# EasyEDA schematic CAN-Breakout.json
TITLE: Sheet_1; REV: 1.0; Date: 2020-12-29; Sheet: 1/1; Drawn By: atanasovgoran94; Company: Your Company
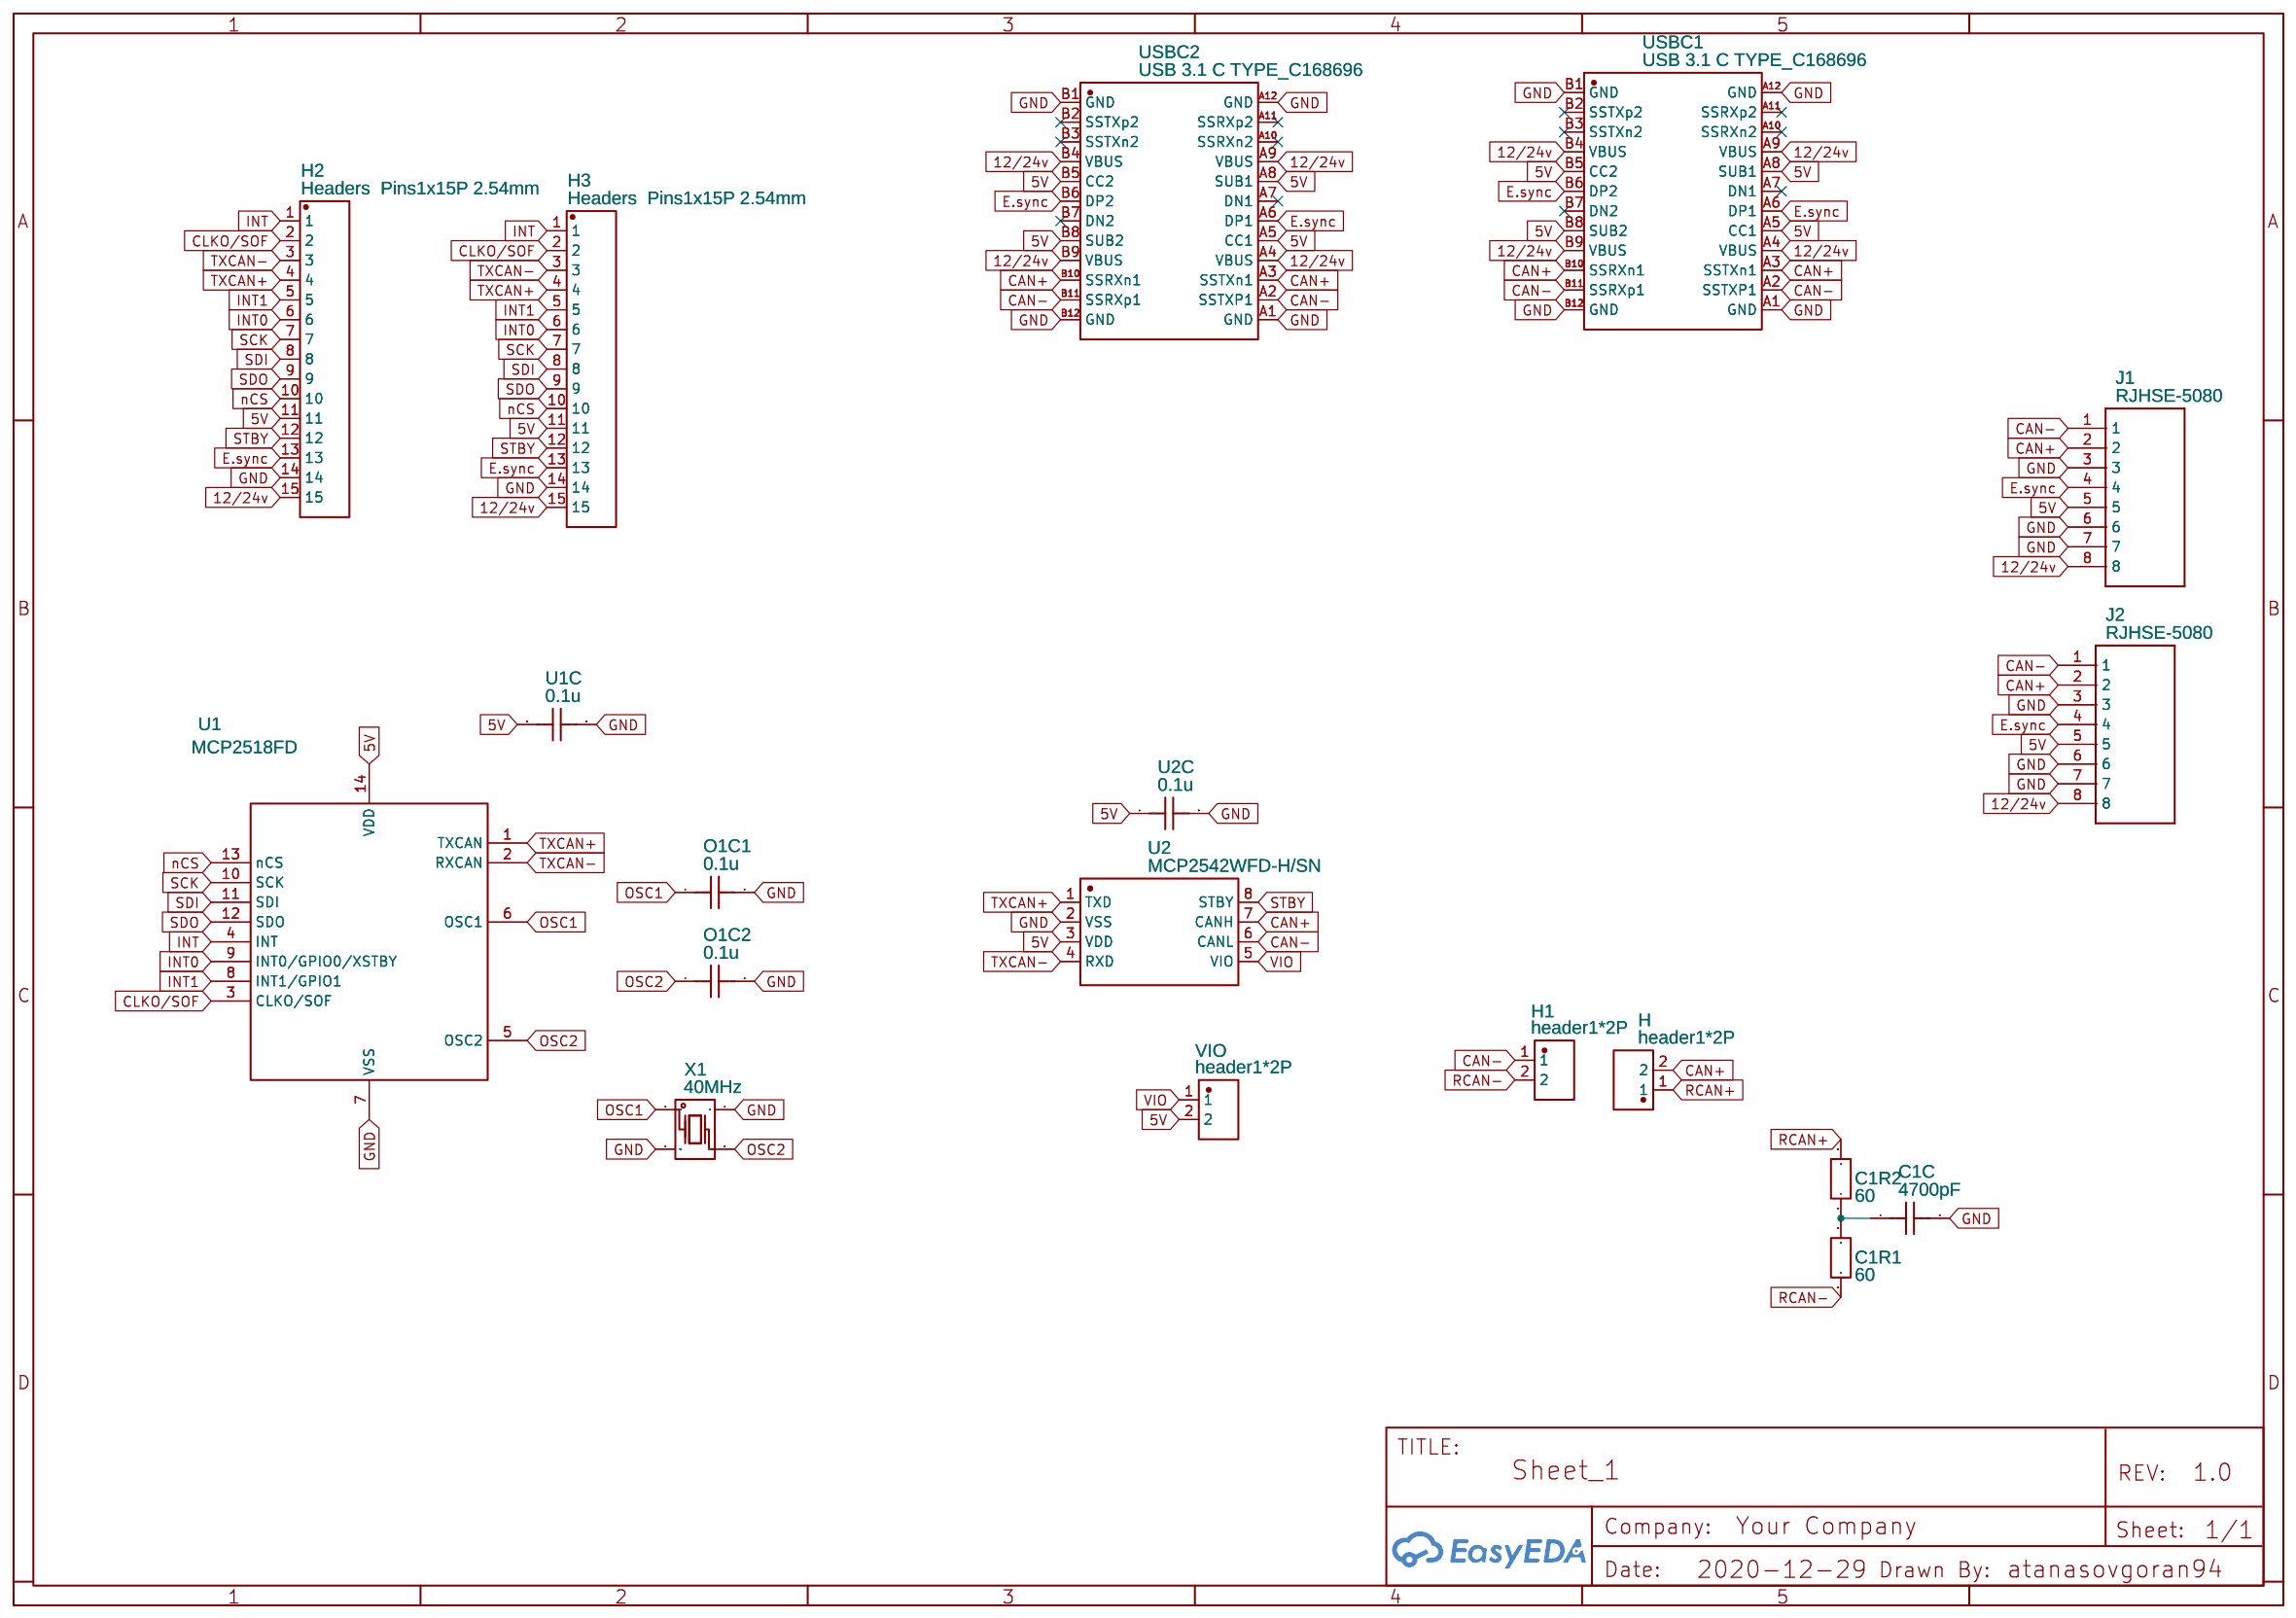
[diagram p0: schematic sheet]

## Parts
C1C  4700pF  [C0402]
C1R1  60  [R0402]
C1R2  60  [R0402]
H  header1*2P  [HDR-TH_2P-P2.00-V]
H1  header1*2P  [HDR-TH_2P-P2.00-V]
H2  Headers  Pins1x15P 2.54mm  [HDR-TH_15P-P2.54-V]
H3  Headers  Pins1x15P 2.54mm  [HDR-TH_15P-P2.54-V]
J1  RJHSE-5080  [AMPHENOL_RJHSE-5080]
J2  RJHSE-5080  [AMPHENOL_RJHSE-5080]
O1C1  0.1u  [C0402]
O1C2  0.1u  [C0402]
U1  MCP2518FD  [MCP2518]
U1C  0.1u  [C0402]
U2  MCP2542WFD-H/SN  [SOIC-8_L4.9-W3.9-P1.27-LS6.0-BL]
U2C  0.1u  [C0402]
USBC1  USB 3.1 C TYPE_C168696  [USB-C-TH_TYPE-USB-3.1-C]
USBC2  USB 3.1 C TYPE_C168696  [USB-C-TH_TYPE-USB-3.1-C]
VIO  header1*2P  [HDR-TH_2P-P2.00-V]
X1  40MHz  [CRISTAL SMD]

## Library data of the parts
C1C O1C1 O1C2 U1C U2C = C_0402_US: Contributor: LCEDA_Lib
C1R1 C1R2 = R_0402_EU: Contributor: LCEDA_Lib
H H1 VIO = Female header1*2P: Supplier: LCSC; Manufacturer: BOOMELE; Supplier Part: C66509
H2 H3 = Headers  Pins1x15P 2.54mm: Supplier Part: C54102; Supplier: LCSC; Manufacturer: ReliaPro; image: http://image.lceda.cn/szlcsc/C54102.jpg
J1 J2 = RJHSE-5080: Contributor: joshvan2
U1 = MCP2518FD: Contributor: luizazv
U2 = MCP2542WFD-H/SN: Supplier: LCSC; Manufacturer: MICROCHIP; Contributor: LCSC; Supplier Part: C144310; SMT Type: Extend; JLCPCB SMD: Yes
USBC1 USBC2 = USB 3.1 C TYPE_C168696: Supplier: LCSC; Supplier Part: C168696; Manufacturer: LCSC; Contributor: atanasovgoran94
X1 = ECX-2236B SMD CRYSTAL: Supplier: Mouser; Supplier Part: C389786; Manufacturer: ECS INC INTERNACIONAL; Manufacturer Part: ECX-2236BSMD CRYSTAL; Contributor: atanasovgoran94; LCSC Assembly: Yes; SMT Type: Extend

## Nets
5V: H2.11 H3.11 J1.5 J2.5 U1.14(VDD) U1C.1 U2.3(VDD) U2C.1 USBC1.A5(CC1) USBC1.A8(SUB1) USBC1.B5(CC2) USBC1.B8(SUB2) USBC2.A5(CC1) USBC2.A8(SUB1) USBC2.B5(CC2) USBC2.B8(SUB2) VIO.2
12/24v: H2.15 H3.15 J1.8 J2.8 USBC1.A4(VBUS) USBC1.A9(VBUS) USBC1.B4(VBUS) USBC1.B9(VBUS) USBC2.A4(VBUS) USBC2.A9(VBUS) USBC2.B4(VBUS) USBC2.B9(VBUS)
GND: C1C.2 H2.14 H3.14 J1.3 J1.6 J1.7 J2.3 J2.6 J2.7 O1C1.2 O1C2.2 U1.7(VSS) U1C.2 U2.2(VSS) U2C.2 USBC1.A1(GND) USBC1.A12(GND) USBC1.B1(GND) USBC1.B12(GND) USBC2.A1(GND) USBC2.A12(GND) USBC2.B1(GND) USBC2.B12(GND) X1.2(GND) X1.4(GND)
CAN+: H.2 J1.2 J2.2 U2.7(CANH) USBC1.A3(SSTXn1) USBC1.B10(SSRXn1) USBC2.A3(SSTXn1) USBC2.B10(SSRXn1)
CAN-: H1.1 J1.1 J2.1 U2.6(CANL) USBC1.A2(SSTXP1) USBC1.B11(SSRXp1) USBC2.A2(SSTXP1) USBC2.B11(SSRXp1)
CLKO/SOF: H2.2 H3.2 U1.3(CLKO/SOF)
E.sync: H2.13 H3.13 J1.4 J2.4 USBC1.A6(DP1) USBC1.B6(DP2) USBC2.A6(DP1) USBC2.B6(DP2)
INT: H2.1 H3.1 U1.4(INT)
INT0: H2.6 H3.6 U1.9(INT0/GPIO0/XSTBY)
INT1: H2.5 H3.5 U1.8(INT1/GPIO1)
nCS: H2.10 H3.10 U1.13(nCS)
OSC1: O1C1.1 U1.6(OSC1) X1.1(IN-OUT)
OSC2: O1C2.1 U1.5(OSC2) X1.3(OUT-IN)
RCAN+: C1R2.2 H.1
RCAN-: C1R1.1 H1.2
SCK: H2.7 H3.7 U1.10(SCK)
SDI: H2.8 H3.8 U1.11(SDI)
SDO: H2.9 H3.9 U1.12(SDO)
STBY: H2.12 H3.12 U2.8(STBY)
TXCAN+: H2.4 H3.4 U1.1(TXCAN) U2.1(TXD)
TXCAN-: H2.3 H3.3 U1.2(RXCAN) U2.4(RXD)
VIO: U2.5(VIO) VIO.1
Net-(C1C-1): C1C.1 C1R1.2 C1R2.1

Not connected (* = marked no-connect by the designer): USBC1 A7(DN1)* A10(SSRXn2)* A11(SSRXp2)* B2(SSTXp2)* B3(SSTXn2)* B7(DN2)*; USBC2 A7(DN1)* A10(SSRXn2)* A11(SSRXp2)* B2(SSTXp2)* B3(SSTXn2)* B7(DN2)*
